# Altium schematic sheet Power Supplies.SchDoc
size 381 x 241 mm; CompanyName: Technische Hochschule Nürnberg Georg Simon Ohm; Organization: UltraZohm; Address1: Kesslerplatz 12; Address2: 90489 Nürnberg; Address3: GERMANY; DocumentNumber: 6; SheetNumber: 6; SheetTotal: 12; Website: www.ultrazohm.com
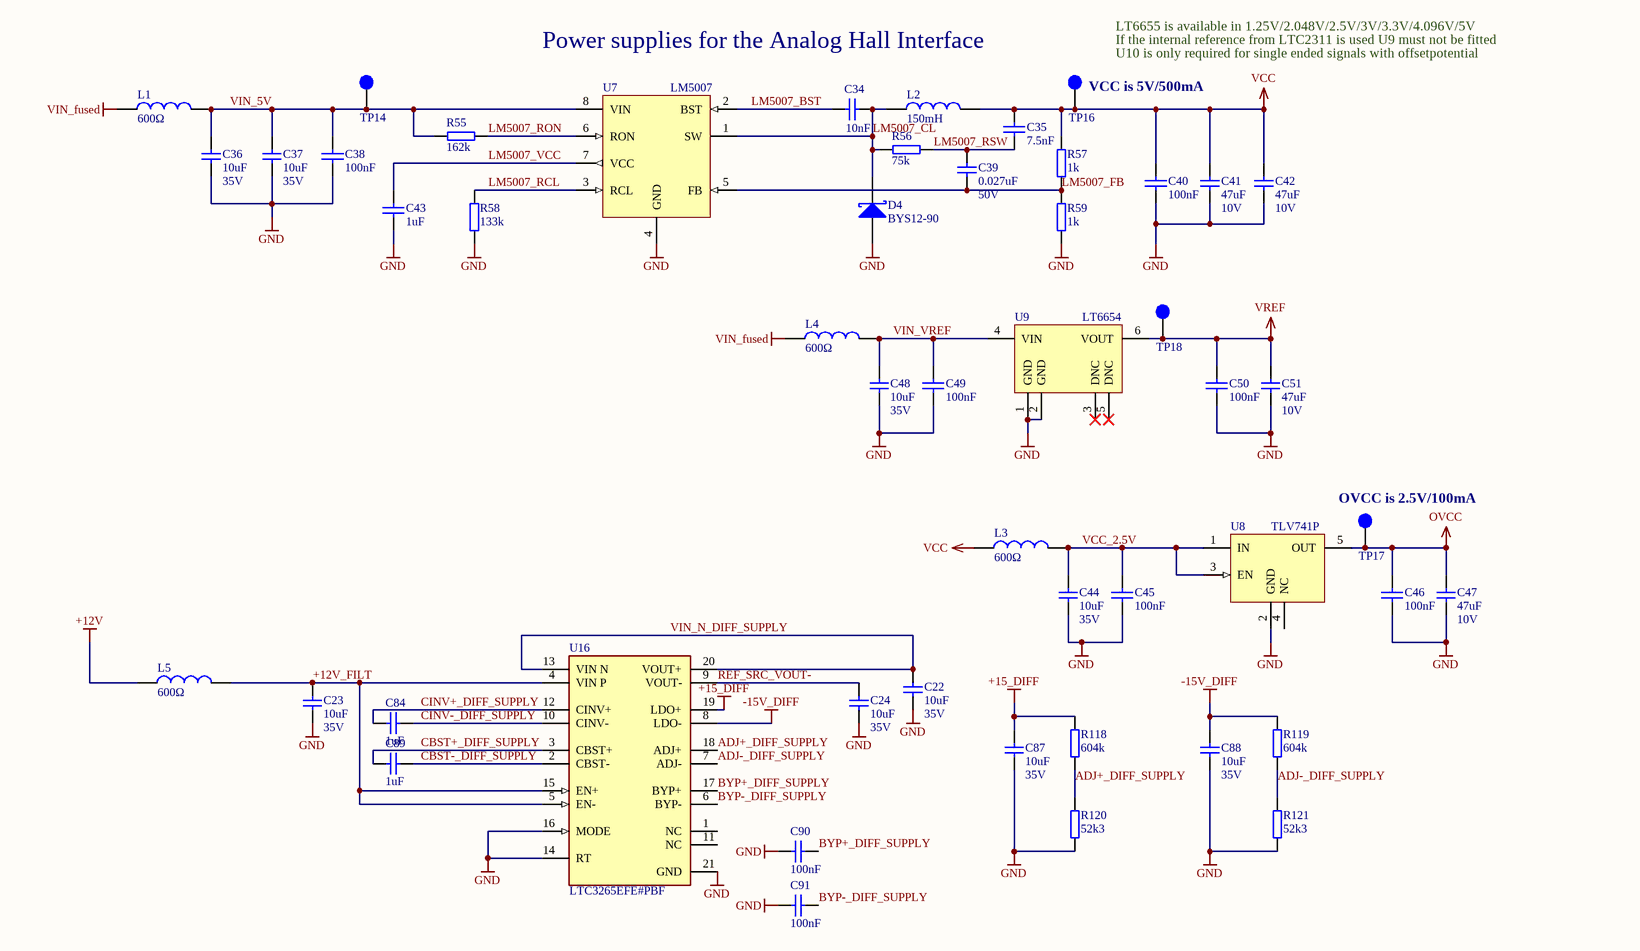
[diagram p0: Power Supplies.SchDoc]

## Parts
C22  10uF  Voltage: 35V  [C_1206]
C23  10uF  Voltage: 35V  [C_1206]
C24  10uF  Voltage: 35V  [C_1206]
C34  10nF  [CAPC1608X07N]
C35  7.5nF  [CAPC1608X07N]
C36  10uF  Voltage: 35V  [C_1206]
C37  10uF  Voltage: 35V  [C_1206]
C38  100nF  [CAPC1608X07N]
C39  0.027uF  Voltage: 50V  [C_1206]
C40  100nF  [CAPC1608X07N]
C41  47uF  Voltage: 10V  [C_1206]
C42  47uF  Voltage: 10V  [C_1206]
C43  1uF  [CAPC1608X07N]
C44  10uF  Voltage: 35V  [C_1206]
C45  100nF  [CAPC1608X07N]
C46  100nF  [CAPC1608X07N]
C47  47uF  Voltage: 10V  [C_1206]
C48  10uF  Voltage: 35V  [C_1206]
C49  100nF  [CAPC1608X07N]
C50  100nF  [CAPC1608X07N]
C51  47uF  Voltage: 10V  [C_1206]
C84  1uF  [CAPC1608X07N]
C87  10uF  Voltage: 35V  [C_1206]
C88  10uF  Voltage: 35V  [C_1206]
C89  1uF  [CAPC1608X07N]
C90  100nF  [CAPC1608X07N]
C91  100nF  [CAPC1608X07N]
D4  BYS12-90  [DIOM4227X23N]
L1  600Ω  [WE-CBF_0805_High Current]
L2  150mH  [SMT_inductor_1050_Performance]
L3  600Ω  [WE-CBF_0805_High Current]
L4  600Ω  [WE-CBF_0805_High Current]
L5  600Ω  [WE-CBF_0805_High Current]
R55  162k  [RESC1608X06N]
R56  75k  [RESC1608X06N]
R57  1k  [RESC1608X06N]
R58  133k  [RESC1608X06N]
R59  1k  [RESC1608X06N]
R118  604k  [RESC1608X06N]
R119  604k  [RESC1608X06N]
R120  52k3  [RESC1608X06N]
R121  52k3  [RESC1608X06N]
TP14  VIN  [TP_1mm]  (value not drawn)
TP16  VCC  [TP_1mm]  (value not drawn)
TP17  OVCC  [TP_1mm]  (value not drawn)
TP18  VREF  [TP_1mm]  (value not drawn)
U7  LM5007  [TSOP65P490X110-8N]
U8  TLV741P  [SOT95P250X110-5N]
U9  LT6654  [SOT95P280X100-6N]
U16  LTC3265EFE#PBF  [FP-FE-20-05-08-1663-MFG]

## Nets
+12V: L5.1
+15_DIFF: C87.2 R118.2 U16.19(LDO+)
-15V_DIFF: C88.2 R119.2 U16.8(LDO-)
GND: C22.1 C23.1 C24.1 C36.1 C37.1 C38.2 C40.1 C41.1 C42.1 C43.1 C44.1 C45.2 C46.2 C47.1 C48.1 C49.2 C50.2 C51.1 C87.1 C88.1 C90.2 C91.2 D4.2(A) R58.1 R59.1 R120.1 R121.1 U7.4(GND) U8.2(GND) U9.1(GND) U9.2(GND) U16.14(RT) U16.16(MODE) U16.21(GND)
OVCC: C46.1 C47.2 TP17.1 U8.5(OUT)
VCC: C35.1 C40.2 C41.2 C42.2 L2.2 L3.1 R57.2 TP16.1
VIN_fused: L1.1 L4.1
VREF: C50.1 C51.2 TP18.1 U9.6(VOUT)
+12V_FILT: C23.2 L5.2 U16.4(VIN_P) U16.5(EN-) U16.15(EN+)
ADJ+_DIFF_SUPPLY: R118.1 R120.2 U16.18(ADJ+)
ADJ-_DIFF_SUPPLY: R119.1 R121.2 U16.7(ADJ-)
BYP+_DIFF_SUPPLY: C90.1 U16.17(BYP+)
BYP-_DIFF_SUPPLY: C91.1 U16.6(BYP-)
CBST+_DIFF_SUPPLY: C89.1 U16.3(CBST+)
CBST-_DIFF_SUPPLY: C89.2 U16.2(CBST-)
CINV+_DIFF_SUPPLY: C84.1 U16.12(CINV+)
CINV-_DIFF_SUPPLY: C84.2 U16.10(CINV-)
LM5007_BST: C34.1 U7.2(BST)
LM5007_CL: C34.2 D4.1(K) L2.1 R56.1 U7.1(SW)
LM5007_FB: C39.1 R57.1 R59.2 U7.5(FB)
LM5007_RCL: R58.2 U7.3(RCL)
LM5007_RON: R55.2 U7.6(RON)
LM5007_RSW: C35.2 C39.2 R56.2
LM5007_VCC: C43.2 U7.7(VCC)
REF_SRC_VOUT-: C24.2 U16.9(VOUT-)
VCC_2.5V: C44.2 C45.1 L3.2 U8.1(IN) U8.3(EN)
VIN_5V: C36.2 C37.2 C38.1 L1.2 R55.1 TP14.1 U7.8(VIN)
VIN_N_DIFF_SUPPLY: C22.2 U16.13(VIN_N) U16.20(VOUT+)
VIN_VREF: C48.2 C49.1 L4.2 U9.4(VIN)

Not connected (* = marked no-connect by the designer): U8 4(NC); U9 3(DNC)* 5(DNC)*; U16 1(NC) 11(NC)

## Notes on the sheet
- (near TP16) Power supplies for the Analog Hall Interface
- LT6655 is available in 1.25V/2.048V/2.5V/3V/3.3V/4.096V/5V
- (near TP16) If the internal reference from LTC2311 is used U9 must not be fitted
- (near TP16) U10 is only required for single ended signals with offsetpotential
- (near TP16) VCC is 5V/500mA
- (near TP17) OVCC is 2.5V/100mA
- Title
- Revision:
- Design Engineer:
- Date:
- Project:
- Sheet
- of

## Library data of the parts
C22-C24 C36 C37 C44 C48 C87 C88 = C_1206: Capacitor 1206; MPN: GRM319R6YA106KA12D; Tolerance: 10%; MF: Murata Electronics; Dielectric: X5R; Package: 1206; Value: 10uF; Created: 2018_06_25_AGeiger; Supplier 1: Mouser; Supplier Part Number 1: 81-GRM319R6YA106KA2D
C34 = Cap_0603: MPN: 885012206065; MF: Würth; Voltage: 25V; Value: 10nF; Supplier 1: Mouser; Supplier 2: *; Supplier Part Number 1: 710-885012206065; Supplier Part Number 2: *
C35 = Cap_0603: MPN: C0603C752J3GACTU; MF: KEMET; Voltage: 25V; Value: 7.5nF; Supplier 1: Mouser; Supplier 2: *; Supplier Part Number 1: 80-C0603C752J3GACTU; Supplier Part Number 2: *
C38 C40 C45 C46 C49 C50 C90 C91 = Cap_0603: MPN: 885012206071; MF: Würth; Voltage: 25V; Value: 100nF; Supplier 1: Mouser; Supplier 2: *; Supplier Part Number 1: 710-885012206071; Supplier Part Number 2: *
C39 = C_1206: Capacitor 1206; MPN: GRM3195C1H273JA01D; Tolerance: 5%; MF: Murata; Dielectric: C0G; Package: 1206; Value: 0.027uF; Created: 2018_06_25_AGeiger; Supplier 1: Mouser; Supplier Part Number 1: 81-GRM315C1H273JA01D
C41 C42 C47 C51 = C_1206: Capacitor 1206; MPN: GRM31CR61A476ME15L; Tolerance: 10%; MF: Murata Electronics; Dielectric: X5R; Package: 1206; Value: 47uF; Created: 2018_06_25_AGeiger; Supplier 1: Mouser; Supplier Part Number 1: 81-GRM31CR61A476ME5L
C43 C84 C89 = Cap_0603: MPN: C0603C105K3R; Voltage: 25V; Value: 1uF
D4 = BYS12-90: Schottky Diode; MPN: BYS12-90-E3/TR3; MF: Vishay; Forward Voltage: 750mV; Reverse Voltage: 90V; Rated Current: 1.5A; Package: DO-214AC; Supplier 1: Farnell; Supplier 2: Mouser; Supplier 3: Digi-Key; Supplier Part Number 1: 2889144; Supplier Part Number 2: 625-BYS12-90-E3/TR3; Supplier Part Number 3: BYS12-90-E3/GICT-ND
L1 L3-L5 = WE-CBF, 742792040: WE-CBF SMD EMI Suppression Ferrite Bead, 0805, 600Ω; MF: Wurth Elektronik; Type: High Current; PublishedDate: Aug 2016; ComponentLink1Description: Manufacturer; ComponentLink1URL: http://www.we-online.de; ComponentLink2Description: Datasheet; ComponentLink2URL: http://katalog.we-online.de/pbs/datasheet/742792040.pdf; MPN: 742792040; Value: 600Ω; Size: 0805; Supplier 1: Farnell; Supplier 2: Mouser; Supplier 3: Digi-Key; Supplier Part Number 1: 2761567; Supplier Part Number 2: 710-742792040; Supplier Part Number 3: 732-1620-1-ND
L2 = B82464G4154M: SMT power Inductor, 150uH, 320m DRC; MF: EPCOS / TDK; Rated Current: 0.85 A; MPN: B82464G4154M; Supplier 1: Mouser; Supplier Part Number 1: 871-B82464G4154M; Value: 150mH; DCR: 320m
R55 = R_0603: MPN: CRCW0603162KFKEA; MF: Vishay; Value: 162k; Supplier 1: Mouser; Supplier Part Number 1: 71-CRCW0603-162K-E3
R56 = R_0603: MPN: RC0603FR-0775KL; MF: Yageo; Value: 75k; Supplier 1: Mouser; Supplier Part Number 1: 603-RC0603FR-0775KL
R57 R59 R118-R121 = R_0603: MPN: RC0603FR-071KL; MF: Yageo; Supplier 1: Mouser; Supplier Part Number 1: 603-RC0603FR-071KL
  R57 R59: Value: 1k
  R118 R119: Value: 604k
  R120 R121: Value: 52k3
R58 = R_0603: MPN: RC0603FR-07133KL; MF: Yageo; Value: 133k; Supplier 1: Mouser; Supplier Part Number 1: 603-RC0603FR-07133KL
TP14 TP16-TP18 = TP_1mm: Testpoint 1mm; Created: 2018_06_25_AGeiger; Value: Testpoint 1mm
U7 = LM5007: Buck Converter, 9-75Vin, 2.5-73Vout; MPN: LM5007MM/NOPB; MF: Texas Instruments; Supplier 1: Farnell; Supplier 2: Mouser; Supplier 3: Digi-Key; Supplier Part Number 1: 9779345; Supplier Part Number 2: 926-LM5007MM/NOPB; Supplier Part Number 3: LM5007MM/NOPBCT-ND; Package: VSSOP-8
U8 = TLV741P: 150mA, 2.5V LDO; MPN: TLV74125PDBVR; MF: Texas Instruments; Supplier 1: Mouser; Supplier 2: Digi-Key; Supplier Part Number 1: 595-TLV74125PDBVR; Supplier Part Number 2: 296-49999-1-ND; Package: SOT-23-5
U9 = LT6654: MPN: LT6654BIS6-5#TRMPBF; MF: Analog Devices; Package: TSOT-23-6; Supplier 1: Farnell; Supplier 2: Mouser; Supplier 3: Digi-Key; Supplier Part Number 1: 2761960; Supplier Part Number 2: 584-6654BIS65TRMPBF; Supplier Part Number 3: LT6654BIS6-5#TRMPBF-ND
U16 = CMP-09139-000006-1: IC REG CHARG PUMP INV DL 20TSSOP; Manufacturer: Analog Devices Inc; Switching Topology: Buck-Boost; Number Of Outputs: 2; Max Junction Temp: +150°C; Output Type: AdjustableProgrammable; Min Supply Voltage: 4.5V; Switching Frequency: 50-500kHz; Max Supply Voltage: 32V; Standoff Height: 0.05mm; Output Voltage: 1.2-32V; Nominal Supply Current: 3-3000uA; Ipc Land Pattern Name: SOP65P640X120-20; Mouser Description: Charge Pump INV/STPUP Automotive 20-Pin TSSOP EP Tube; Manufacturer Part Number: LTC3265EFE#PBF; ComponentLink2Description: Datasheet; Device Class L2: Power Management ICs; Octopart: https://octopart.com/ltc3265efe%23pbf-analog+devices-88944569; Height: 1.2mm; RoHS: TRUE; Category: IC; Digikey Description: IC REG CHARG PUMP INV DL 20TSSOP; ComponentLink2URL: https://www.analog.com/media/en/technical-documentation/data-sheets/3265fa.pdf; Package: FE-20-05-08-1663; Device Class L1: Integrated Circuits (ICs); Temperature Range High: +125°C; Temperature: -40°C to +125°C; Device Class L3: Voltage Regulators - Switching; Automotive: No; Lead Free: Yes; Temperature Range Low: -40°C